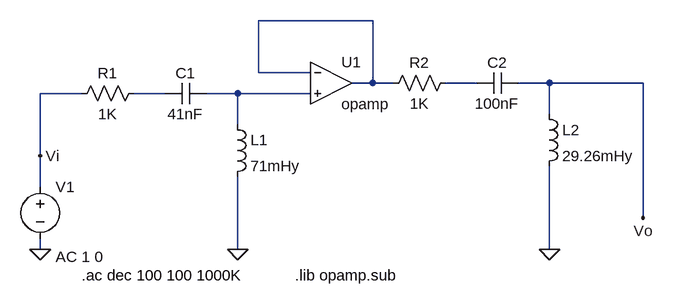
[diagram p0: schematic ts3.asc]
ts3.asc, the LTspice schematic file:
Version 4
SHEET 1 880 680
WIRE 272 96 96 96
WIRE 96 176 96 96
WIRE 176 176 96 176
WIRE 272 192 272 96
WIRE 272 192 240 192
WIRE 304 192 272 192
WIRE 432 192 384 192
WIRE 544 192 496 192
WIRE 688 192 544 192
WIRE -176 208 -240 208
WIRE -48 208 -96 208
WIRE 64 208 16 208
WIRE 176 208 64 208
WIRE 544 240 544 192
WIRE 64 256 64 208
WIRE -240 304 -240 208
WIRE -240 352 -240 304
WIRE 688 400 688 192
WIRE -240 448 -240 432
WIRE 64 448 64 336
WIRE 544 448 544 320
FLAG -240 448 0
FLAG -240 304 Vi
FLAG 688 400 Vo
FLAG 64 448 0
FLAG 544 448 0
SYMBOL voltage -240 336 R0
WINDOW 123 24 124 Left 2
WINDOW 39 0 0 Left 0
SYMATTR Value2 AC 1 0
SYMATTR InstName V1
SYMATTR Value ""
SYMBOL res -80 192 R90
WINDOW 0 0 56 VBottom 2
WINDOW 3 32 56 VTop 2
SYMATTR InstName R1
SYMATTR Value 1K
SYMBOL cap 16 192 R90
WINDOW 0 0 32 VBottom 2
WINDOW 3 32 32 VTop 2
SYMATTR InstName C1
SYMATTR Value 41nF
SYMBOL ind 48 240 R0
SYMATTR InstName L1
SYMATTR Value 71mHy
SYMBOL OpAmps\\opamp 208 128 R0
SYMATTR InstName U1
SYMBOL res 400 176 R90
WINDOW 0 0 56 VBottom 2
WINDOW 3 32 56 VTop 2
SYMATTR InstName R2
SYMATTR Value 1K
SYMBOL cap 496 176 R90
WINDOW 0 0 32 VBottom 2
WINDOW 3 32 32 VTop 2
SYMATTR InstName C2
SYMATTR Value 100nF
SYMBOL ind 528 224 R0
SYMATTR InstName L2
SYMATTR Value 29.26mHy
TEXT 152 488 Left 2 !.lib opamp.sub
TEXT -176 488 Left 2 !.ac dec 100 100 1000K

The netlist it stands for:
* ts3.asc
V1 Vi 0 AC 1 0
R1 N003 Vi 1K
C1 N004 N003 41nF
L1 N004 0 71mHy
XU1 N001 N004 N001 opamp Aol=100K GBW=10Meg  ; pins invin noninvin out
R2 N002 N001 1K
C2 Vo N002 100nF
L2 Vo 0 29.26mHy
.lib opamp.sub
.ac dec 100 100 1000K
.backanno
.end